# Altium schematic sheet 20_MCU_BLE.SchDoc
size A; SheetNumber: 3; SheetTotal: 8
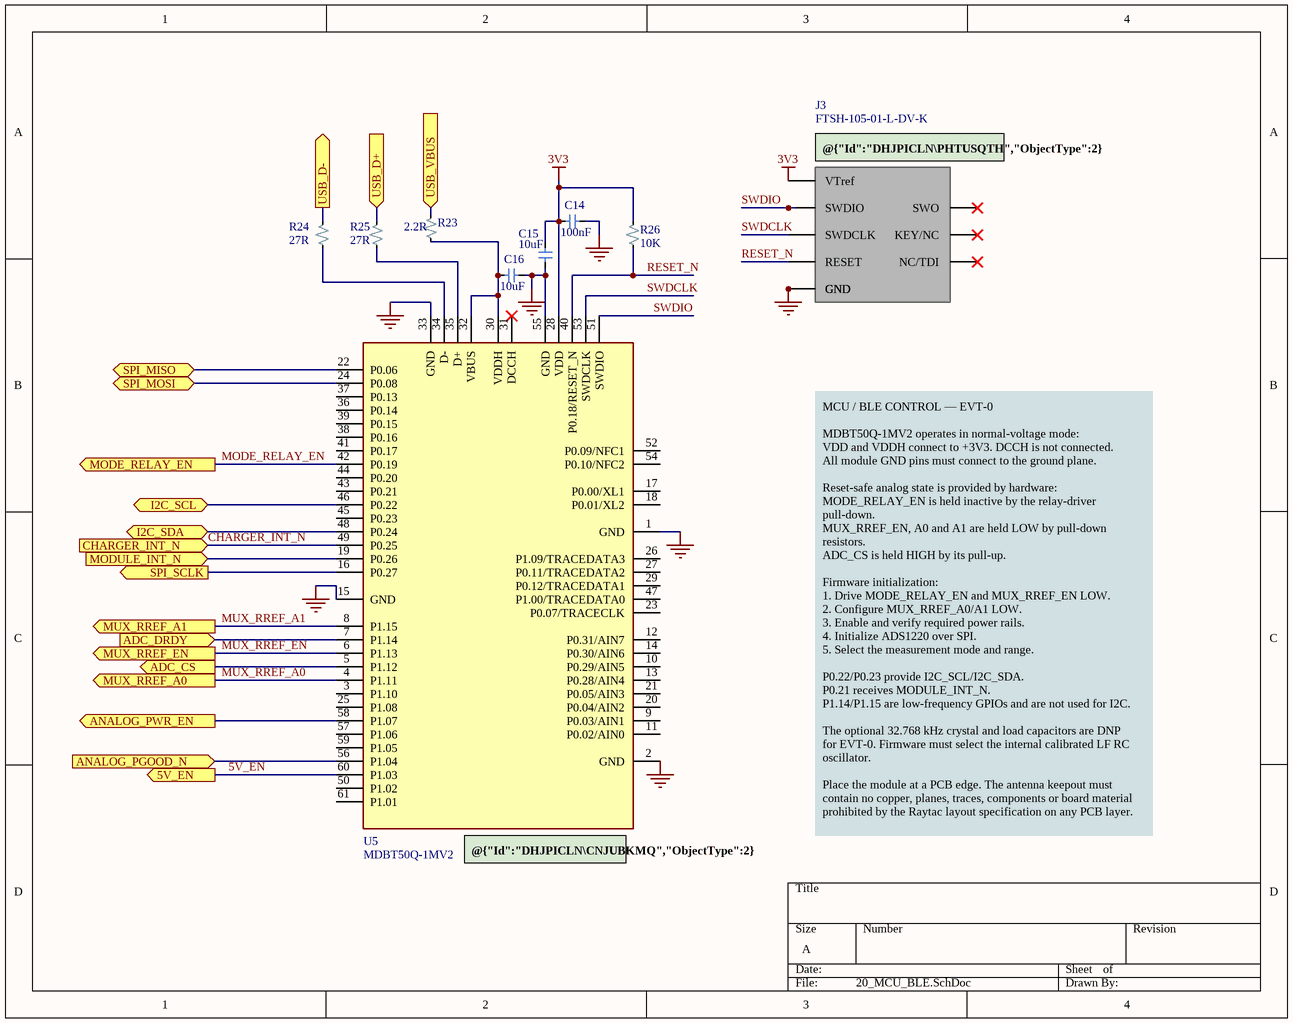
[diagram p0: 20_MCU_BLE.SchDoc]

## Parts
C14  100nF  [C0805]
C15  10uF  [C0805]
C16  10uF  [C0805]
J3  FTSH-105-01-L-DV-K  [FTSH-105-01-L-DV-K]
R23  2.2R  [R0805]
R24  27R  [R0805]
R25  27R  [R0805]
R26  10K  [R0805]
U5  MDBT50Q-1MV2  [NRF52840_MDBT50Q-1MV2]

## Ports
5V_EN (out, see 00_SYSTEM_TOP[2B], 10_POWER[1A]), ADC_CS (out, see 00_SYSTEM_TOP[2C], 30_ADC[4C]), ADC_DRDY (in, see 00_SYSTEM_TOP[2C], 30_ADC[4C]), ANALOG_PGOOD_N (in, see 00_SYSTEM_TOP[2B], 10_POWER[2A]), ANALOG_PWR_EN (out, see 00_SYSTEM_TOP[2B], 10_POWER[2B]), CHARGER_INT_N (in, see 00_SYSTEM_TOP[2B], 10_POWER[2C]), I2C_SCL (bidir, see 00_SYSTEM_TOP[2B], 10_POWER[3C], 70_MODULE_INTERFACE[3C]), I2C_SDA (bidir, see 00_SYSTEM_TOP[2B], 10_POWER[3C], 70_MODULE_INTERFACE[3C]), MODE_RELAY_EN (out, see 00_SYSTEM_TOP[3B], 40_INPUT_ROUTING[3B]), MODULE_INT_N (in, see 00_SYSTEM_TOP[2B], 70_MODULE_INTERFACE[2C]), MUX_RREF_A0 (out, see 00_SYSTEM_TOP[3B], 60_RESISTANCE_FRONTEND[3C]), MUX_RREF_A1 (out, see 00_SYSTEM_TOP[3B], 60_RESISTANCE_FRONTEND[3C]), MUX_RREF_EN (out, see 00_SYSTEM_TOP[3B], 60_RESISTANCE_FRONTEND[3C]), SPI_MISO (bidir, see 00_SYSTEM_TOP[2C], 30_ADC[4C], 70_MODULE_INTERFACE[4C]), SPI_MOSI (bidir, see 00_SYSTEM_TOP[2C], 30_ADC[4C], 70_MODULE_INTERFACE[4C]), SPI_SCLK (out, see 00_SYSTEM_TOP[2C], 30_ADC[4C], 70_MODULE_INTERFACE[4C]), USB_D+ (in, see 00_SYSTEM_TOP[2B], 10_POWER[2D]), USB_D- (out, see 00_SYSTEM_TOP[2B], 10_POWER[2D]), USB_VBUS (in, see 00_SYSTEM_TOP[2B], 10_POWER[2D])

## Nets
3V3: C14.1 C15.1 J3.1(VTref) R26.2 U5.28(VDD)
GND: C14.2 C15.2 C16.2 J3.3(GND) J3.5(GND) J3.9(GND) U5.1(GND) U5.2(GND) U5.15(GND) U5.33(GND) U5.55(GND)
5V_EN: U5.60(P1.03) ; port 5V_EN
ADC_CS: U5.5(P1.12) ; port ADC_CS
ADC_DRDY: U5.7(P1.14) ; port ADC_DRDY
ANALOG_PGOOD_N: U5.56(P1.04) ; port ANALOG_PGOOD_N
ANALOG_PWR_EN: U5.58(P1.07) ; port ANALOG_PWR_EN
CHARGER_INT_N: U5.49(P0.25) ; port CHARGER_INT_N
I2C_SCL: U5.46(P0.22) ; port I2C_SCL
I2C_SDA: U5.48(P0.24) ; port I2C_SDA
MODE_RELAY_EN: U5.42(P0.19) ; port MODE_RELAY_EN
MODULE_INT_N: U5.19(P0.26) ; port MODULE_INT_N
MUX_RREF_A0: U5.4(P1.11) ; port MUX_RREF_A0
MUX_RREF_A1: U5.8(P1.15) ; port MUX_RREF_A1
MUX_RREF_EN: U5.6(P1.13) ; port MUX_RREF_EN
RESET_N: J3.10(RESET) R26.1 U5.40(P0.18/RESET_N)
SPI_MISO: U5.22(P0.06) ; port SPI_MISO
SPI_MOSI: U5.24(P0.08) ; port SPI_MOSI
SPI_SCLK: U5.16(P0.27) ; port SPI_SCLK
SWDCLK: J3.4(SWDCLK) U5.53(SWDCLK)
SWDIO: J3.2(SWDIO) U5.51(SWDIO)
USB_D+: R25.2 ; port USB_D+
USB_D-: R24.2 ; port USB_D-
USB_VBUS: R23.2 ; port USB_VBUS
NetC16_1: C16.1 R23.1 U5.30(VDDH) U5.32(VBUS)
NetR24_1: R24.1 U5.34(D-)
NetR25_1: R25.1 U5.35(D+)

Not connected (* = marked no-connect by the designer): J3 6(SWO)* 7(KEY/NC)* 8(NC/TDI)*; U5 3(P1.10) 9(P0.03/AIN1) 10(P0.29/AIN5) 11(P0.02/AIN0) 12(P0.31/AIN7) 13(P0.28/AIN4) 14(P0.30/AIN6) 17(P0.00/XL1) 18(P0.01/XL2) 20(P0.04/AIN2) 21(P0.05/AIN3) 23(P0.07/TRACECLK) 25(P1.08) 26(P1.09/TRACEDATA3) 27(P0.11/TRACEDATA2) 29(P0.12/TRACEDATA1) 31(DCCH)* 36(P0.14) 37(P0.13) 38(P0.16) 39(P0.15) 41(P0.17) 43(P0.21) 44(P0.20) 45(P0.23) 47(P1.00/TRACEDATA0) 50(P1.02) 52(P0.09/NFC1) 54(P0.10/NFC2) 57(P1.06) 59(P1.05) 61(P1.01)

## Notes on the sheet
- (near J3) @{"Id":"DHJPICLN\PHTUSQTH","ObjectType":2} 10-PIN Header (MCU Prog)
- MCU / BLE CONTROL — EVT-0
  MDBT50Q-1MV2 operates in normal-voltage mode:
  VDD and VDDH connect to +3V3. DCCH is not connected.
  All module GND pins must connect to the ground plane.
  Reset-safe analog state is provided by hardware:
  MODE_RELAY_EN is held inactive by the relay-driver pull-down.
  MUX_RREF_EN, A0 and A1 are held LOW by pull-down resistors.
  ADC_CS is held HIGH by its pull-up.
  Firmware initialization:
  1. Drive MODE_RELAY_EN and MUX_RREF_EN LOW.
  2. Configure MUX_RREF_A0/A1 LOW.
  3. Enable and verify required power rails.
  4. Initialize ADS1220 over SPI.
  5. Select the measurement mode and range.
  P0.22/P0.23 provide I2C_SCL/I2C_SDA.
  P0.21 receives MODULE_INT_N.
  P1.14/P1.15 are low-frequency GPIOs and are not used for I2C.
  The optional 32.768 kHz crystal and load capacitors are DNP
  for EVT-0. Firmware must select the internal calibrated LF RC
  oscillator.
  Place the module at a PCB edge. The antenna keepout must contain no copper, planes, traces, components or board material prohibited by the Raytac layout specification on any PCB layer.
- (near U5) @{"Id":"DHJPICLN\CNJUBKMQ","ObjectType":2} BLE MCU nRF52840

## Library data of the parts
C14-C16 = C_0805
J3 = FTSH-105-01-L-DV-K: CONN HEADER SMD 10POS 1.27MM / Connector Header Surface Mount 10 position 0.050" (1.27mm); Manufacturer: Samtec; Manufacturer Lifecycle Status: PRODUCTION; Connector Type: Male Pin; Gender: Female; Max Current Rating: 1.75A; Number of Contacts: 10; Supplier: DigiKey; Supplier Part Number: SAM8799-ND; Manufacturer Part Number: FTSH-105-01-L-DV-K; RoHS: Compliant; Category: Headers and Wire Housings; Stock: 47624; Pricing: 1=1.37, 100=1.075, 250=0.972, 500=0.855, 1000=0.753, 2500=0.68, 5000=0.607, 10000=0.52375 (USD); Color: Black; Contact Material: Bronze; Contact Mating Length: 3.048mm; Contact Plating: Gold; Depth: 3.43mm; Housing Color: Black; Housing Material: Polymer; Lead Free: Lead Free; Length: 6.35mm; Lifecycle Status: Production; Max Operating Temperature: 125°C; Min Operating Temperature: -55°C; Mounting Technology: Surface Mount; Pins: 10; Number of Positions: 10; Number of Rows: 2; Pitch: 1.27mm; Radiation Hardening: No; REACH SVHC: No; Row Spacing: 1.27mm; Termination: Solder; ComponentLink1URL: https://datasheet.octopart.com:443/FTSH-105-01-L-DV-K-Samtec-datasheet-140825048.pdf?src-supplier=Electro+Sonic; ComponentLink1Description: https://datasheet.octopart.com:443/FTSH-105-01-L-DV-K-Samtec-datasheet-140825048.pdf?src-supplier=Electro+Sonic; ComponentLink2URL: https://datasheet.octopart.com:443/FTSH-105-01-L-DV-K-Samtec-datasheet-86818370.pdf?src-supplier=Upverter; ComponentLink2Description: https://datasheet.octopart.com:443/FTSH-105-01-L-DV-K-Samtec-datasheet-86818370.pdf?src-supplier=Upverter; ComponentLink3URL: https://datasheet.octopart.com:443/FTSH-105-01-L-DV-K-Samtec-datasheet-97029545.pdf?src-supplier=Newark; ComponentLink3Description: https://datasheet.octopart.com:443/FTSH-105-01-L-DV-K-Samtec-datasheet-97029545.pdf?src-supplier=Newark; ComponentLink4URL: https://datasheet.octopart.com:443/FTSH-105-01-L-DV-K-Samtec-datasheet-41642889.pdf?src-supplier=Newark; ComponentLink4Description: https://datasheet.octopart.com:443/FTSH-105-01-L-DV-K-Samtec-datasheet-41642889.pdf?src-supplier=Newark; ComponentLink5URL: https://sigma.octopart.com:443/140871554/technical_drawing/Samtec-FTSH-105-01-L-DV-K.pdf?src-supplier=Samtec; ComponentLink5Description: https://sigma.octopart.com:443/140871554/technical_drawing/Samtec-FTSH-105-01-L-DV-K.pdf?src-supplier=Samtec; ComponentLink6URL: https://sigma.octopart.com:443/97029548/technical_drawing/Samtec-FTSH-105-01-L-DV-K.pdf?src-supplier=Samtec; ComponentLink6Description: https://sigma.octopart.com:443/97029548/technical_drawing/Samtec-FTSH-105-01-L-DV-K.pdf?src-supplier=Samtec; ComponentLink7URL: https://datasheet.octopart.com:443/FTSH-105-01-L-DV-K-Samtec-datasheet-100454331.pdf?src-supplier=Farnell; ComponentLink7Description: https://datasheet.octopart.com:443/FTSH-105-01-L-DV-K-Samtec-datasheet-100454331.pdf?src-supplier=Farnell; ComponentLink8URL: https://datasheet.octopart.com:443/FTSH-105-01-L-DV-K-Samtec-datasheet-33007714.pdf?src-supplier=Farnell; ComponentLink8Description: https://datasheet.octopart.com:443/FTSH-105-01-L-DV-K-Samtec-datasheet-33007714.pdf?src-supplier=Farnell; ComponentLink9URL: https://datasheet.octopart.com:443/FTSH-105-01-L-DV-K-Samtec-datasheet-16646209.pdf?src-supplier=element14+APAC; ComponentLink9Description: https://datasheet.octopart.com:443/FTSH-105-01-L-DV-K-Samtec-datasheet-16646209.pdf?src-supplier=element14+APAC; ComponentLink10URL: https://datasheet.octopart.com:443/FTSH-105-01-L-DV-K-Samtec-datasheet-180249087.pdf?src-supplier=JRH+Electronics; ComponentLink10Description: https://datasheet.octopart.com:443/FTSH-105-01-L-DV-K-Samtec-datasheet-180249087.pdf?src-supplier=JRH+Electronics; ComponentLink11URL: https://datasheet.octopart.com:443/FTSH-105-01-L-DV-K-Samtec-datasheet-176663386.pdf?src-supplier=Toby+Electronics; ComponentLink11Description: https://datasheet.octopart.com:443/FTSH-105-01-L-DV-K-Samtec-datasheet-176663386.pdf?src-supplier=Toby+Electronics; ComponentLink12URL: https://datasheet.octopart.com:443/FTSH-105-01-L-DV-K-Samtec-datasheet-133497664.pdf?src-supplier=Toby+Electronics; ComponentLink12Description: https://datasheet.octopart.com:443/FTSH-105-01-L-DV-K-Samtec-datasheet-133497664.pdf?src-supplier=Toby+Electronics; ComponentLink13URL: https://datasheet.octopart.com:443/FTSH-105-01-L-DV-K-Samtec-datasheet-116535196.pdf?src-supplier=Toby+Electronics; ComponentLink13Description: https://datasheet.octopart.com:443/FTSH-105-01-L-DV-K-Samtec-datasheet-116535196.pdf?src-supplier=Toby+Electronics; ComponentLink14URL: https://datasheet.octopart.com:443/FTSH-105-01-L-DV-K-Samtec-datasheet-151470459.pdf?src-supplier=Sager+Electronics; ComponentLink14Description: https://datasheet.octopart.com:443/FTSH-105-01-L-DV-K-Samtec-datasheet-151470459.pdf?src-supplier=Sager+Electronics; ComponentLink15URL: https://datasheet.octopart.com:443/FTSH-105-01-L-DV-K-Samtec-datasheet-151470458.pdf?src-supplier=Sager+Electronics; ComponentLink15Description: https://datasheet.octopart.com:443/FTSH-105-01-L-DV-K-Samtec-datasheet-151470458.pdf?src-supplier=Sager+Electronics; ComponentLink16URL: https://datasheet.octopart.com:443/FTSH-105-01-L-DV-K-Samtec-datasheet-137316104.pdf?src-supplier=Future+Electronics; ComponentLink16Description: https://datasheet.octopart.com:443/FTSH-105-01-L-DV-K-Samtec-datasheet-137316104.pdf?src-supplier=Future+Electronics; ComponentLink17URL: https://datasheet.octopart.com/FTSH-105-01-L-DV-K-Samtec-datasheet-13696953.pdf; ComponentLink17Description: https://datasheet.octopart.com/FTSH-105-01-L-DV-K-Samtec-datasheet-13696953.pdf; ComponentLink18URL: https://datasheet.octopart.com/FTSH-105-01-L-DV-K-Samtec-datasheet-11553404.pdf; ComponentLink18Description: https://datasheet.octopart.com/FTSH-105-01-L-DV-K-Samtec-datasheet-11553404.pdf
R23-R26 = R_0805: RES 1/8W 0805; Manufacturer: Stackpole Electronics; Manufacturer Part Number: RNCF0805TKY10K0; Manufacturer Package Identifier: 0805 (2012 metric); Max Power Dissipation: 125mW; Value: 10kΩ; Temperature Coefficient: 5ppm/°C; Tolerance: 0.01%; Working Voltage: 150V; Supplier: DigiKey; Supplier Part Number: RNCF0805TKY10K0CT-ND; RoHS: Compliant; Category: Chip SMD Resistors; Stock: 4649; Pricing: 1=1.61, 10=1.334, 50=1.1716, 100=1.1105, 500=0.99044, 1000=0.94751, 2000=0.90945, 3000=0.8893, 5000=0.86599, 7000=0.85183, 10000=0.8378 (USD); Case/Package: 0805; Case Code (Imperial): 0805; Case Code (Metric): 2012; Composition: Thin Film; Country of Origin: Taiwan; Export Control Classification Number (ECCN) Code: EAR99; Features: Moisture Resistant; Height: 550µm; Harmonized Tariff Schedule (HTS) Code: 8533.21.00.30; Introduction Date: 2011-06-03; Lead Free: Lead Free; Length: 2mm; Lifecycle Status: Production; Max Operating Temperature: 155°C; Min Operating Temperature: -55°C; Mounting Technology: Surface Mount; Number of Terminals: 2; Number of Terminations: 2; Packaging: Tape & Reel (TR); Power Rating: 125mW; Ratings: AEC-Q200; REACH SVHC: Yes; Schedule B: 8533210045, 8533210045|8533210045|8533210045|8533210045|8533210045; Width: 1.25mm; ComponentLink1URL: https://datasheet.octopart.com:443/RNCF0805TKY10K0-Stackpole-Electronics-datasheet-182148124.pdf?src-supplier=IHS; ComponentLink1Description: https://datasheet.octopart.com:443/RNCF0805TKY10K0-Stackpole-Electronics-datasheet-182148124.pdf?src-supplier=IHS; ComponentLink2URL: https://datasheet.octopart.com:443/RNCF0805TKY10K0-Stackpole-Electronics-datasheet-12511394.pdf?src-supplier=Factory+Futures; ComponentLink2Description: https://datasheet.octopart.com:443/RNCF0805TKY10K0-Stackpole-Electronics-datasheet-12511394.pdf?src-supplier=Factory+Futures; ComponentLink3URL: https://datasheet.octopart.com:443/RNCF0805TKY10K0-Stackpole-Electronics-datasheet-141158876.pdf?src-supplier=Stackpole+Electronics; ComponentLink3Description: https://datasheet.octopart.com:443/RNCF0805TKY10K0-Stackpole-Electronics-datasheet-141158876.pdf?src-supplier=Stackpole+Electronics; ComponentLink4URL: https://datasheet.octopart.com:443/RNCF0805TKY10K0-Stackpole-Electronics-datasheet-28504821.pdf?src-supplier=Master+Electronics; ComponentLink4Description: https://datasheet.octopart.com:443/RNCF0805TKY10K0-Stackpole-Electronics-datasheet-28504821.pdf?src-supplier=Master+Electronics; ComponentLink5URL: https://datasheet.octopart.com/RNCF0805TKY10K0-Stackpole-Electronics-datasheet-11755897.pdf; ComponentLink5Description: https://datasheet.octopart.com/RNCF0805TKY10K0-Stackpole-Electronics-datasheet-11755897.pdf; ComponentLink6URL: http://sigma.octopart.com:80/15941409/materials_sheet/Stackpole-Electronics-RNCF0805TKY10K0.pdf?src-supplier=Compliance+Statements; ComponentLink6Description: http://sigma.octopart.com:80/15941409/materials_sheet/Stackpole-Electronics-RNCF0805TKY10K0.pdf?src-supplier=Compliance+Statements; ComponentLink7URL: http://sigma.octopart.com:80/141158212/rohs_statement/Stackpole-Electronics-RNCF0805TKY10K0.pdf?src-supplier=Compliance+Statements; ComponentLink7Description: http://sigma.octopart.com:80/141158212/rohs_statement/Stackpole-Electronics-RNCF0805TKY10K0.pdf?src-supplier=Compliance+Statements; ComponentLink8URL: http://sigma.octopart.com:80/141158211/reach_statement/Stackpole-Electronics-RNCF0805TKY10K0.pdf?src-supplier=Compliance+Statements; ComponentLink8Description: http://sigma.octopart.com:80/141158211/reach_statement/Stackpole-Electronics-RNCF0805TKY10K0.pdf?src-supplier=Compliance+Statements
U5 = MDBT50Q-1MV2: 802.15.4, Bluetooth Bluetooth v5.4, ZigbeeÂ® Transceiver Module 2.36GHz ~ 2.5GHz Integrated, Chip Surface Mount; MF: Raytac Corporation; SnapEDA_Link: https://www.snapeda.com/parts/MDBT50Q-1MV2/Raytac+Corporation/view-part/?ref=snap; Package: SMD-61 Raytac Corporation; Value: *; MP: MDBT50Q-1MV2; Check_prices: https://www.snapeda.com/parts/MDBT50Q-1MV2/Raytac+Corporation/view-part/?ref=eda